# EAGLE design motor_module (EAGLE 6.5.0)
AUTHOR: Austin Buchan; DESIGN_NAME: MotorModule; REVISION: 0.0; YEAR: 2014

## Sheet 1 of 3: Power
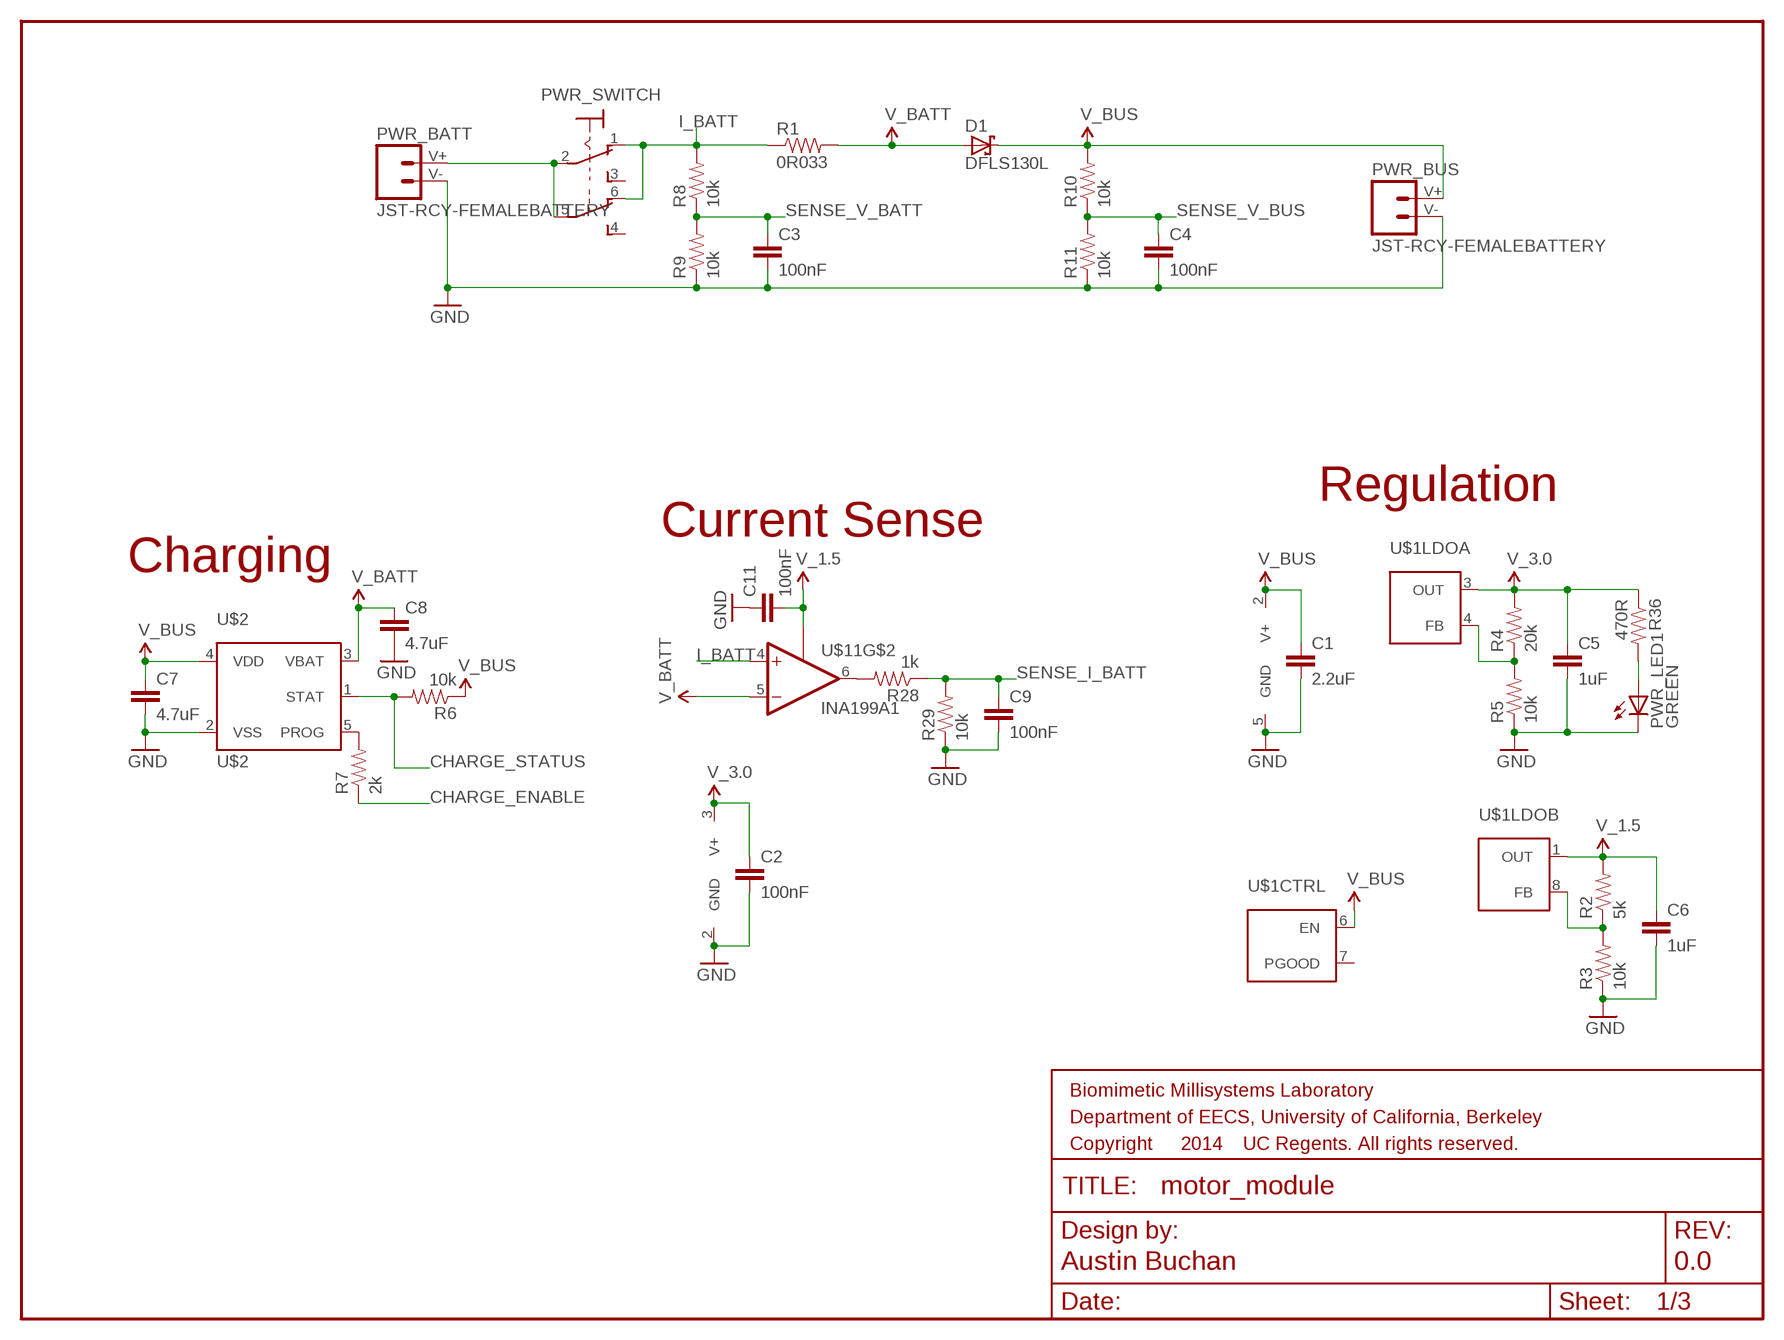
[diagram p0: schematic, sheet 1]
FRAME1 (FRAME-LETTER): SHEET_NAME: Power

### Parts
C1  2.2uF  CAP0402-CAP  [0402-CAP]
C2  100nF  CAP0402-CAP  [0402-CAP]
C3  100nF  CAP0402-CAP  [0402-CAP]
C4  100nF  CAP0402-CAP  [0402-CAP]
C5  1uF  CAP0402-CAP  [0402-CAP]
C6  1uF  CAP0402-CAP  [0402-CAP]
C7  4.7uF  CAP0402-CAP  [0402-CAP]
C8  4.7uF  CAP0402-CAP  [0402-CAP]
C9  100nF  CAP0402-CAP  [0402-CAP]
C11  100nF  CAP0402-CAP  [0402-CAP]
D1  DFLS130L  [POWERDI123]
PWR_BATT  JST-RCY-FEMALEBATTERY  [TP_LIPO_160MAH]
PWR_BUS  JST-RCY-FEMALEBATTERY  [TP_LIPO_160MAH]
PWR_LED1  GREEN  LED0603  [LED-0603]
PWR_SWITCH  JS202011SCQN  [JS202011SCQN]
R1  0R033  RESISTOR0603-RES  [0603-RES]
R2  5k  RESISTOR0402-RES  [0402-RES]
R3  10k  RESISTOR0402-RES  [0402-RES]
R4  20k  RESISTOR0402-RES  [0402-RES]
R5  10k  RESISTOR0402-RES  [0402-RES]
R6  10k  RESISTOR0402-RES  [0402-RES]
R7  2k  RESISTOR0402-RES  [0402-RES]
R8  10k  RESISTOR0402-RES  [0402-RES]
R9  10k  RESISTOR0402-RES  [0402-RES]
R10  10k  RESISTOR0402-RES  [0402-RES]
R11  10k  RESISTOR0402-RES  [0402-RES]
R28  1k  RESISTOR0402-RES  [0402-RES]
R29  10k  RESISTOR0402-RES  [0402-RES]
R36  470R  RESISTOR0402-RES  [0402-RES]
U$1  SC560C  [MLPQ-UT8]
U$2  MCP73831T  [SOT23-5]
U$11  INA199A1  [SC70-6]

### Nets
CHARGE_ENABLE: R7.1 ; also sheet 3
CHARGE_STATUS: R6.2 U$2.1(STAT) ; also sheet 3
GND: C1.2 C2.2 C3.2 C4.2 C5.2 C6.2 C7.2 C8.2 C9.2 C11.1 PWR_BATT.V- PWR_BUS.V- PWR_LED1.C R3.1 R5.1 R9.1 R11.1 R29.1 U$1.5(GND) U$2.2(VSS) U$11.2(GND) ; also sheet 2,3
I_BATT: PWR_SWITCH.1(O) PWR_SWITCH.6(O) R1.1 R8.2 U$11.4(+IN)
N$1: PWR_BATT.V+ PWR_SWITCH.2(P) PWR_SWITCH.5(P)
N$2: R2.1 R3.2 U$1.8(LDOB:FB)
N$3: R4.1 R5.2 U$1.4(LDOA:FB)
N$4: R7.2 U$2.5(PROG)
N$6: R28.2 U$11.6(OUT)
N$7: PWR_LED1.A R36.2
SENSE_I_BATT: C9.1 R28.1 R29.2 ; also sheet 3
SENSE_V_BATT: C3.1 R8.1 R9.2 ; also sheet 3
SENSE_V_BUS: C4.1 R10.1 R11.2 ; also sheet 3
V_1.5: C6.1 C11.2 R2.2 U$1.1(LDOB:OUT) U$11.1(REF) ; also sheet 2
V_3.0: C2.1 C5.1 R4.2 R36.1 U$1.3(LDOA:OUT) U$11.3(V+) ; also sheet 2,3
V_BATT: C8.1 D1.A R1.2 U$2.3(VBAT) U$11.5(-IN) ; also sheet 2
V_BUS: C1.1 C7.1 D1.C PWR_BUS.V+ R6.1 R10.2 U$1.2(V+) U$1.6(CTRL:EN) U$2.4(VDD)
Unconnected: PWR_SWITCH.3(S) PWR_SWITCH.4(S) U$1.7(CTRL:PGOOD)

### Notes on the sheet
- Regulation
- Current Sense
- Charging

## Sheet 2 of 3: Motor
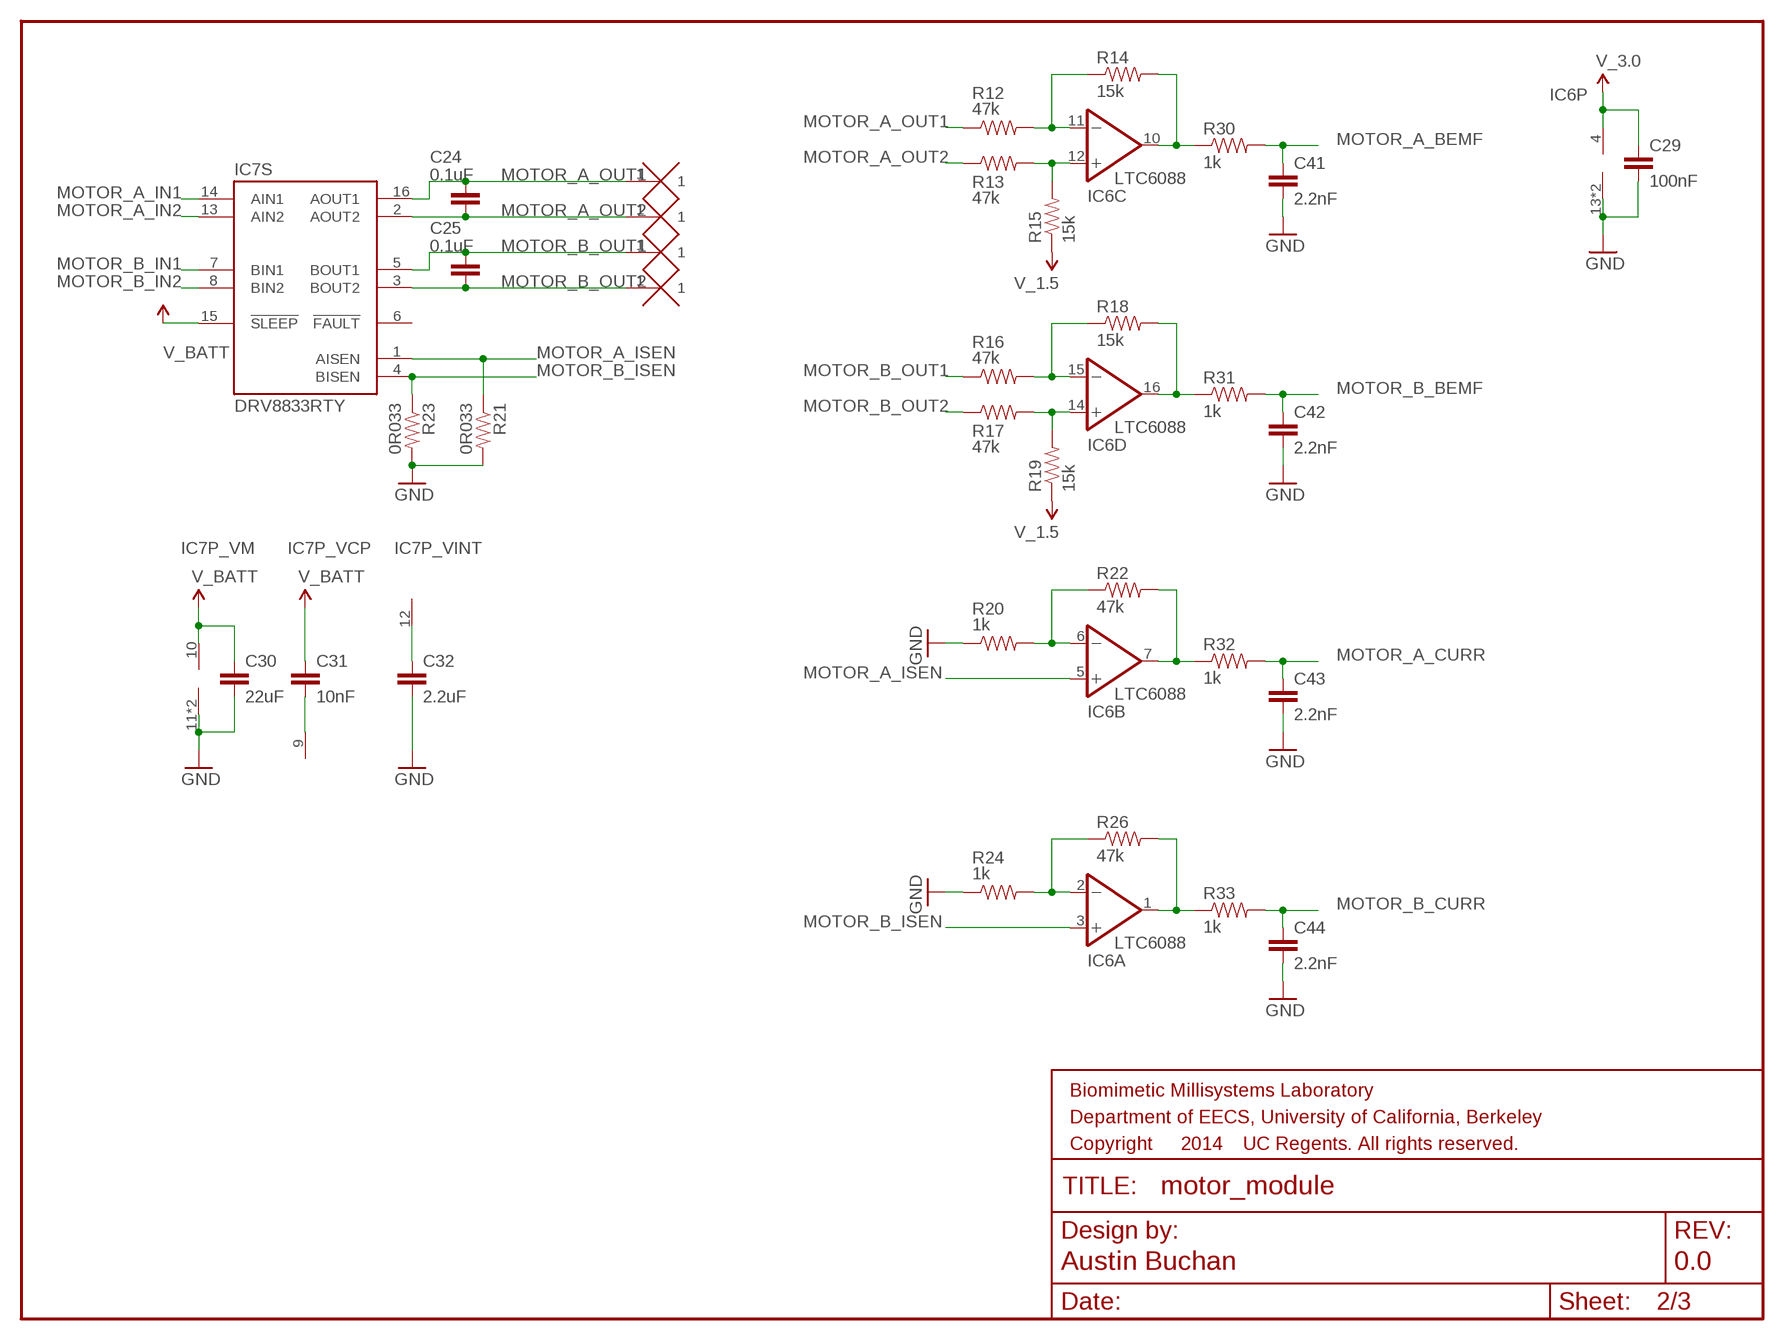
[diagram p1: schematic, sheet 2]
FRAME3 (FRAME-LETTER): SHEET_NAME: Motor

### Parts
C24  0.1uF  CAP0402-CAP  [0402-CAP]
C25  0.1uF  CAP0402-CAP  [0402-CAP]
C29  100nF  CAP0402-CAP  [0402-CAP]
C30  22uF  CAP0603-CAP  [0603-CAP]
C31  10nF  CAP0402-CAP  [0402-CAP]
C32  2.2uF  CAP0402-CAP  [0402-CAP]
C41  2.2nF  CAP0402-CAP  [0402-CAP]
C42  2.2nF  CAP0402-CAP  [0402-CAP]
C43  2.2nF  CAP0402-CAP  [0402-CAP]
C44  2.2nF  CAP0402-CAP  [0402-CAP]
IC6  LTC6088  [DFN-16]
IC7  DRV8833RTY  [S-PWQFN-N16]
MA1  PAD-0.6_1.8  [PAD_0.6_1.8]
MA2  PAD-0.6_1.8  [PAD_0.6_1.8]
MB1  PAD-0.6_1.8  [PAD_0.6_1.8]
MB2  PAD-0.6_1.8  [PAD_0.6_1.8]
R12  47k  RESISTOR0402-RES  [0402-RES]
R13  47k  RESISTOR0402-RES  [0402-RES]
R14  15k  RESISTOR0402-RES  [0402-RES]
R15  15k  RESISTOR0402-RES  [0402-RES]
R16  47k  RESISTOR0402-RES  [0402-RES]
R17  47k  RESISTOR0402-RES  [0402-RES]
R18  15k  RESISTOR0402-RES  [0402-RES]
R19  15k  RESISTOR0402-RES  [0402-RES]
R20  1k  RESISTOR0402-RES  [0402-RES]
R21  0R033  RESISTOR0603-RES  [0603-RES]
R22  47k  RESISTOR0402-RES  [0402-RES]
R23  0R033  RESISTOR0603-RES  [0603-RES]
R24  1k  RESISTOR0402-RES  [0402-RES]
R26  47k  RESISTOR0402-RES  [0402-RES]
R30  1k  RESISTOR0402-RES  [0402-RES]
R31  1k  RESISTOR0402-RES  [0402-RES]
R32  1k  RESISTOR0402-RES  [0402-RES]
R33  1k  RESISTOR0402-RES  [0402-RES]

### Nets
GND: C29.2 C30.2 C32.2 C41.2 C42.2 C43.2 C44.2 IC6.13(P:V-) IC6.PAD(P:V-) IC7.11(P_VM:V-) IC7.PPAD(P_VM:V-) R20.1 R21.2 R23.2 R24.1 ; also sheet 1,3
MOTOR_A_BEMF: C41.1 R30.2 ; also sheet 3
MOTOR_A_CURR: C43.1 R32.2 ; also sheet 3
MOTOR_A_IN1: IC7.14(S:AIN1) ; also sheet 3
MOTOR_A_IN2: IC7.13(S:AIN2) ; also sheet 3
MOTOR_A_ISEN: IC6.5(B:+IN) IC7.1(S:AISEN) R21.1
MOTOR_A_OUT1: C24.1 IC7.16(S:AOUT1) MA1.1 R12.1
MOTOR_A_OUT2: C24.2 IC7.2(S:AOUT2) MA2.1 R13.1
MOTOR_B_BEMF: C42.1 R31.2 ; also sheet 3
MOTOR_B_CURR: C44.1 R33.2 ; also sheet 3
MOTOR_B_IN1: IC7.7(S:BIN1) ; also sheet 3
MOTOR_B_IN2: IC7.8(S:BIN2) ; also sheet 3
MOTOR_B_ISEN: IC6.3(A:+IN) IC7.4(S:BISEN) R23.1
MOTOR_B_OUT1: C25.1 IC7.5(S:BOUT1) MB1.1 R16.1
MOTOR_B_OUT2: C25.2 IC7.3(S:BOUT2) MB2.1 R17.1
N$5: C31.2 IC7.9(P_VCP:V+)
N$18: C32.1 IC7.12(P_VINT:V-)
N$22: IC6.15(D:-IN) R16.2 R18.1
N$23: IC6.14(D:+IN) R17.2 R19.2
N$24: IC6.6(B:-IN) R20.2 R22.1
N$26: IC6.2(A:-IN) R24.2 R26.1
N$30: IC6.11(C:-IN) R12.2 R14.1
N$31: IC6.12(C:+IN) R13.2 R15.2
N$34: IC6.1(A:OUT) R26.2 R33.1
N$35: IC6.7(B:OUT) R22.2 R32.1
N$36: IC6.10(C:OUT) R14.2 R30.1
N$37: IC6.16(D:OUT) R18.2 R31.1
V_1.5: R15.1 R19.1 ; also sheet 1
V_3.0: C29.1 IC6.4(P:V+) ; also sheet 1,3
V_BATT: C30.1 C31.1 IC7.10(P_VM:V+) IC7.15(S:!SLEEP) ; also sheet 1
Unconnected: IC7.6(S:!FAULT)

## Sheet 3 of 3: Microcontroller
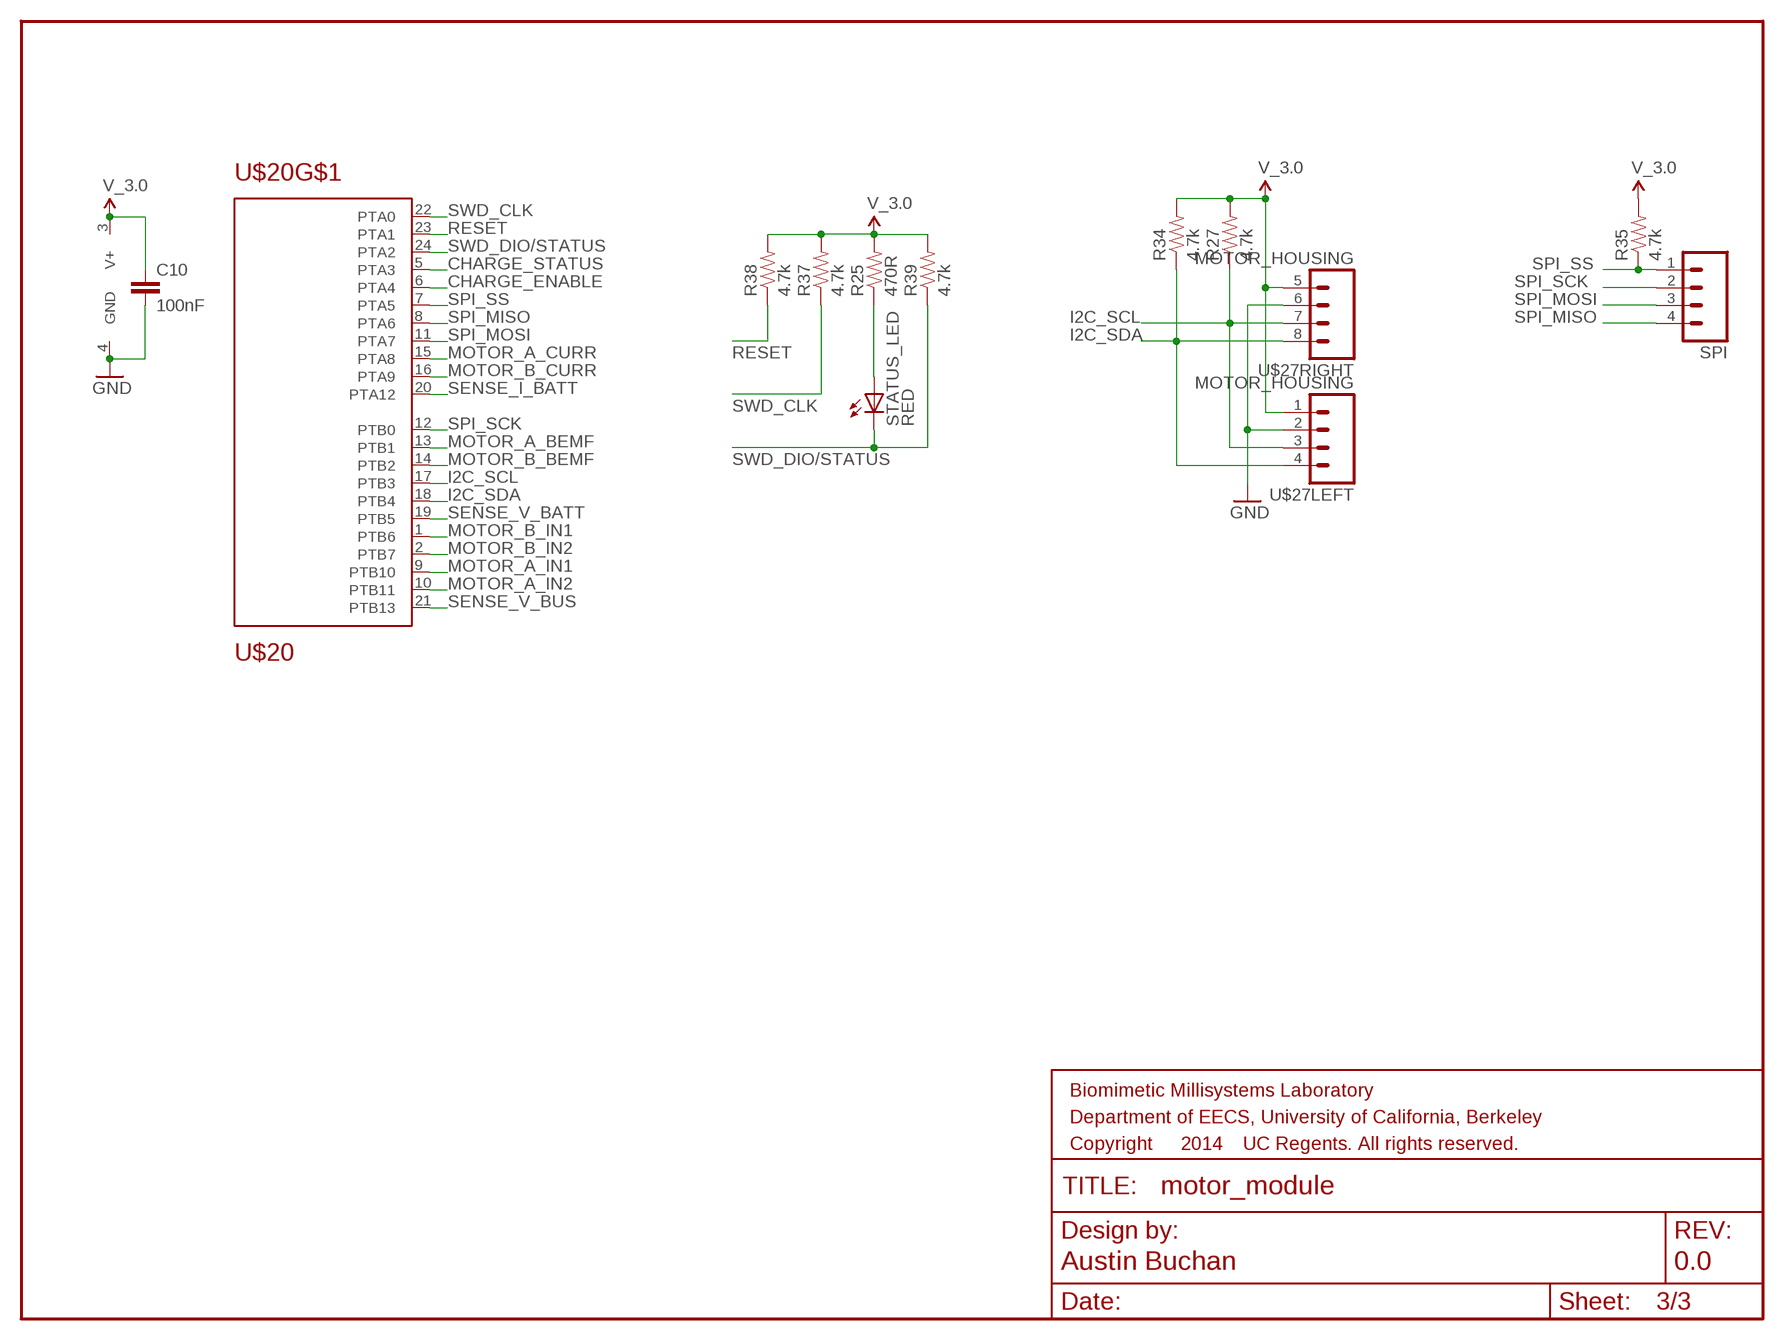
[diagram p2: schematic, sheet 3]

### Parts
C10  100nF  CAP0402-CAP  [0402-CAP]
R25  470R  RESISTOR0402-RES  [0402-RES]
R27  4.7k  RESISTOR0402-RES  [0402-RES]
R34  4.7k  RESISTOR0402-RES  [0402-RES]
R35  4.7k  RESISTOR0402-RES  [0402-RES]
R37  4.7k  RESISTOR0402-RES  [0402-RES]
R38  4.7k  RESISTOR0402-RES  [0402-RES]
R39  4.7k  RESISTOR0402-RES  [0402-RES]
SPI  M04FFC  [MOLEX_503480-0400]
STATUS_LED  RED  LED0603  [LED-0603]
U$20  MKL05Z32VFK4  [QFN-24]
U$27  MOTOR_HOUSING  [MOTOR_HOUSING]

### Nets
CHARGE_ENABLE: U$20.6(PTA4) ; also sheet 1
CHARGE_STATUS: U$20.5(PTA3) ; also sheet 1
GND: C10.2 U$20.4(GND) U$27.2 U$27.6 ; also sheet 1,2
I2C_SCL: R27.1 U$20.17(PTB3) U$27.3 U$27.7
I2C_SDA: R34.1 U$20.18(PTB4) U$27.4 U$27.8
MOTOR_A_BEMF: U$20.13(PTB1) ; also sheet 2
MOTOR_A_CURR: U$20.15(PTA8) ; also sheet 2
MOTOR_A_IN1: U$20.9(PTB10) ; also sheet 2
MOTOR_A_IN2: U$20.10(PTB11) ; also sheet 2
MOTOR_B_BEMF: U$20.14(PTB2) ; also sheet 2
MOTOR_B_CURR: U$20.16(PTA9) ; also sheet 2
MOTOR_B_IN1: U$20.1(PTB6) ; also sheet 2
MOTOR_B_IN2: U$20.2(PTB7) ; also sheet 2
N$8: R25.1 STATUS_LED.A
RESET: R38.1 U$20.23(PTA1)
SENSE_I_BATT: U$20.20(PTA12) ; also sheet 1
SENSE_V_BATT: U$20.19(PTB5) ; also sheet 1
SENSE_V_BUS: U$20.21(PTB13) ; also sheet 1
SPI_MISO: SPI.4 U$20.8(PTA6)
SPI_MOSI: SPI.3 U$20.11(PTA7)
SPI_SCK: SPI.2 U$20.12(PTB0)
SPI_SS: R35.1 SPI.1 U$20.7(PTA5)
SWD_CLK: R37.1 U$20.22(PTA0)
SWD_DIO/STATUS: R39.1 STATUS_LED.C U$20.24(PTA2)
V_3.0: C10.1 R25.2 R27.2 R34.2 R35.2 R37.2 R38.2 R39.2 U$20.3(V+) U$27.1 U$27.5 ; also sheet 1,2

## Library data of the parts
C1-C11 C29 C30 C41-C44 = biomimetic:CAP: Capacitor Standard 0603 ceramic capacitor, and 0.1" leaded capacitor.
C24 C25 = biomimetic:CAP: Capacitor Standard 0603 ceramic capacitor, and 0.1" leaded capacitor.; TECHNOLOGY: CERAMIC; VOLTAGE: 10V
C31 = biomimetic:CAP: Capacitor Standard 0603 ceramic capacitor, and 0.1" leaded capacitor.; DIELECTRIC: X7R; TECHNOLOGY: CERAMIC; VOLTAGE: 16V
C32 = biomimetic:CAP: Capacitor Standard 0603 ceramic capacitor, and 0.1" leaded capacitor.; TECHNOLOGY: CERAMIC; VOLTAGE: 6.3V
D1 = modular_robotics:DFLS130L
IC6 = biomimetic:LTC6088: 14MHz, Rail-to-Rail Output, 12nV/Hz, 1.1mA Op Amp Source: http://cds.linear.com/docs/Datasheet/60878fb.pdf Digi-Key P/N: LTC6088HDHC#PBF-ND
IC7 = biomimetic:DRV8833: TI DRV8833 1.5A Dual H-Bridge Motor Driver IC Digi-Key P/N: 296-29513-6-ND
MA1 MA2 MB1 MB2 = modular_robotics:PAD
PWR_BATT PWR_BUS = modular_robotics:JST-RCY-FEMALE
PWR_LED1 STATUS_LED = biomimetic:LED: LEDs Standard schematic elements and footprints for 5mm, 3mm, 1206, and 0603 sized LEDs. 5mm - Spark Fun Electronics SKU : COM-00529 (and others)
PWR_SWITCH = modular_robotics:JS202011SCQN
R1-R11 R21 R23 R25 R27-R39 = biomimetic:RESISTOR: Resistor Basic schematic elements and footprints for 0603, 1206, and PTH resistors.
R12-R20 R22 R24 R26 = biomimetic:RESISTOR: Resistor Basic schematic elements and footprints for 0603, 1206, and PTH resistors.; TOLERANCE: 1%
SPI = modular_robotics:M04: Header 4 Standard 4-pin 0.1" header. Use with straight break away headers (SKU : PRT-00116), right angle break away headers (PRT-00553), swiss pins (PRT-00743), machine pins (PRT-00117), and female headers (PRT-00115). Molex polarized connector foot print use with SKU : PRT-08231 with associated crimp pins and housings. 1MM SMD Version SKU: PRT-10208
U$1 = modular_robotics:SC560C
U$2 = modular_robotics:MCP73831T
U$11 = modular_robotics:INA199A1
U$20 = modular_robotics:MKL05Z32VFK4
U$27 = modular_robotics:MOTOR_HOUSING

## Board
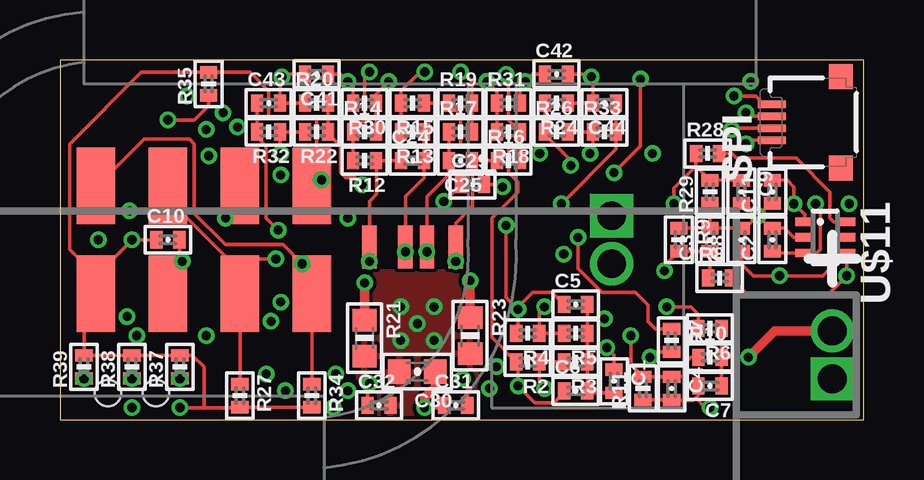
[diagram p3: board, top side]
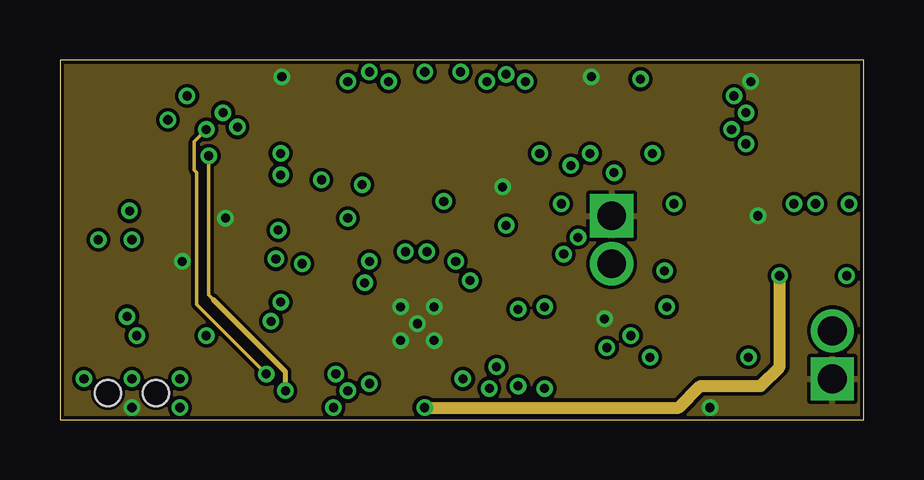
[diagram p4: board, inner layer Route2]
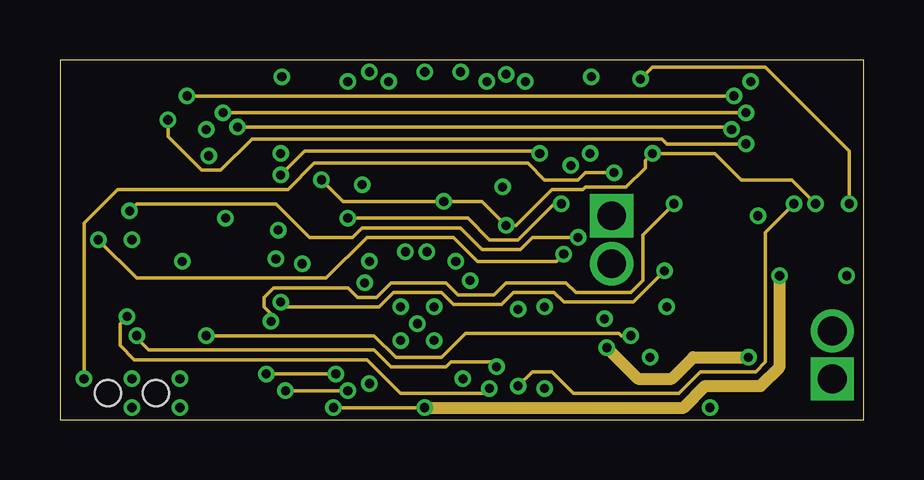
[diagram p5: board, inner layer Route15]
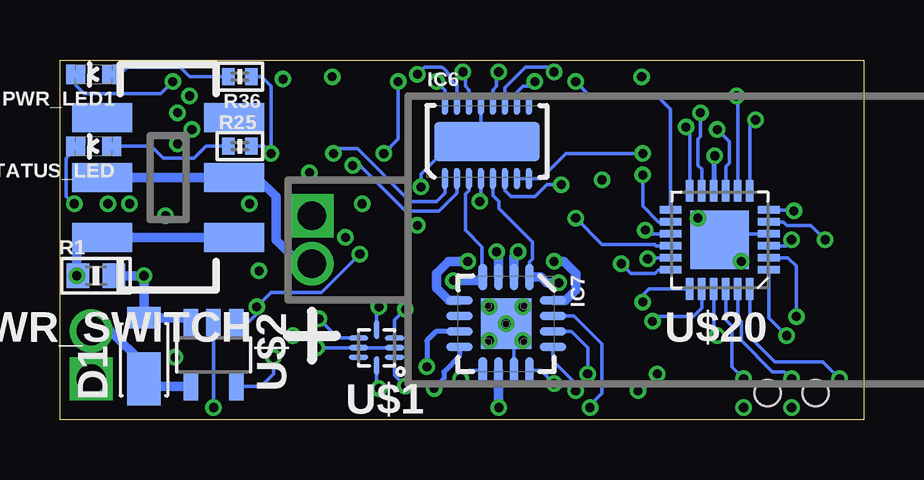
[diagram p6: board, bottom side, seen from below]

Size 33.5 x 15 mm. Coordinates in mm from the lower left corner, seen from the top.
Outline: 0,15 0,0 33.5,0 33.5,15 0,15
Copper layers (1*2+15*16): Top 0.035mm / dielectric 1.5mm / Route2 0.035mm / dielectric 0.15mm / Route15 0.035mm / dielectric 0.2mm / Bottom 0.035mm
Design rules "66each *": minimum track width 6mil, minimum drill 15mil, track to track 6mil, track to pad 6mil, pad to pad 6mil, via to via 6mil, smd to smd 6mil, copper to edge 6mil, drill to drill 6mil, minimum pad ring 6mil, minimum via ring 6mil, stop-mask expansion 4mil, vias tented up to drill 25mil, thermal gap 6mil
Holes 1.1 mm at 2,1.1 4,1.1

### Footprints (pad centres in the part's own frame; a part is rotated, then mirrored left to right if it is on the bottom)
0402-CAP = smd 0.508 x 0.711: 1 -0.483,0; 2 0.483,0
0603-CAP = smd 0.94 x 1.016: 1 -0.749,0; 2 0.749,0
POWERDI123 = smd 0.9 x 1.4: A 0.95,0 | smd 2.2 x 1.4: C -1.6,0
DFN-16 = smd 0.25 x 0.9: 1 -1.75,-1.55; 2 -1.25,-1.55; 3 -0.75,-1.55; 4 -0.25,-1.55; 5 0.25,-1.55; 6 0.75,-1.55; 7 1.25,-1.55; 8 1.75,-1.55; 9 1.75,1.55; 10 1.25,1.55; 11 0.75,1.55; 12 0.25,1.55; 13 -0.25,1.55; 14 -0.75,1.55; 15 -1.25,1.55; 16 -1.75,1.55 | smd 4.4 x 1.65: PAD 0,0
S-PWQFN-N16 = smd 1.1 x 0.35: 1 -1.95,0.975; 2 -1.95,0.325; 3 -1.95,-0.325; 4 -1.95,-0.975; 9 1.95,-0.975; 10 1.95,-0.325; 11 1.95,0.325; 12 1.95,0.975 | smd 0.35 x 1.1: 5 -0.975,-1.95; 6 -0.325,-1.95; 7 0.325,-1.95; 8 0.975,-1.95; 13 0.975,1.95; 14 0.325,1.95; 15 -0.325,1.95; 16 -0.975,1.95 | smd 2.1 x 2.1: PPAD 0,0
PAD_0.6_1.8 = smd 0.6 x 1.8: 1 0,0
TP_LIPO_160MAH = drill 1.2 pad 1.6: V+ -1,0 | drill 1.2 pad 1.6 square: V- 1,0
LED-0603 = smd 0.8 x 0.8: A 0,-0.75; C 0,0.75
JS202011SCQN = smd 1.2 x 2.5: 1 -2.5,-2.75; 2 0,-2.75; 3 2.5,-2.75; 4 2.5,2.75; 5 0,2.75; 6 -2.5,2.75
0603-RES = smd 0.94 x 1.016: 1 -0.749,0; 2 0.749,0
0402-RES = smd 0.508 x 0.711: 1 -0.483,0; 2 0.483,0
MOLEX_503480-0400 = smd 0.3 x 1.15: 1 -0.75,1.725; 2 -0.25,1.725; 3 0.25,1.725; 4 0.75,1.725 | smd 1.035 x 1: L -1.907,-1.15; R 1.907,-1.15
MLPQ-UT8 = smd 0.8 x 0.2: 1 -0.75,0.4; 2 -0.75,0; 3 -0.75,-0.4; 5 0.75,-0.4; 6 0.75,0; 7 0.75,0.4 | smd 0.2 x 0.8: 4 0,-0.75; 8 0,0.75
SOT23-5 = smd 0.6 x 1.2: 1 -0.95,-1.306; 2 0,-1.306; 3 0.95,-1.306; 4 0.95,1.306; 5 -0.95,1.306
SC70-6 = smd 0.35 x 0.8: 1 -0.65,-0.85; 2 0,-0.85; 3 0.65,-0.85; 4 0.65,0.85; 5 0,0.85; 6 -0.65,0.85
QFN-24 = smd 0.9 x 0.3: 1 -2.05,1.25; 2 -2.05,0.75; 3 -2.05,0.25; 4 -2.05,-0.25; 5 -2.05,-0.75; 6 -2.05,-1.25; 13 2.05,-1.25; 14 2.05,-0.75; 15 2.05,-0.25; 16 2.05,0.25; 17 2.05,0.75; 18 2.05,1.25 | smd 0.3 x 0.9: 7 -1.25,-2.05; 8 -0.75,-2.05; 9 -0.25,-2.05; 10 0.25,-2.05; 11 0.75,-2.05; 12 1.25,-2.05; 19 1.25,2.05; 20 0.75,2.05; 21 0.25,2.05; 22 -0.25,2.05; 23 -0.75,2.05; 24 -1.25,2.05 | smd 2.45 x 2.45: EP 0,0
MOTOR_HOUSING = smd 1.6 x 3.2: 1 -4.5,-2.25; 2 -1.5,-2.25; 3 1.5,-2.25; 4 4.5,-2.25; 5 4.5,2.25; 6 1.5,2.25; 7 -1.5,2.25; 8 -4.5,2.25

### Placement (x,y rotation side)
C1  23.1,1.6 270 top
C2  29.7,7.5 90 top
C3  27.1,7.5 90 top
C4  25.5,1.3 270 top
C5  21.5,4.8 0 top
C6  21.5,1.2 0 top
C7  27.1,1.4 180 top
C8  28.4,7.5 90 top
C9  28.4,9.5 270 top
C10  4.5,7.5 0 top
C11  29.7,9.5 90 top
C24  14.7,10.8 0 top
C25  16.7,10.8 180 top
C29  17.2,9.8 0 top
C30  14.9,2 180 top
C31  16.5,0.6 0 top
C32  13.3,0.6 0 top
C41  10.7,14.4 180 top
C42  20.7,14.4 0 top
C43  8.7,13.2 0 top
C44  22.7,13.2 180 top
D1  30,3.3 90 bottom
IC6  15.7,11.6 0 bottom
IC7  14.9,4 270 bottom
MA1  12.9,7.2 0 top
MA2  14.4,7.2 180 top
MB1  16.5,7.2 0 top
MB2  15.3,7.2 180 top
PWR_BATT  23,7.5 90 bottom
PWR_BUS  32.2,2.7 270 top
PWR_LED1  32.1,14.4 90 bottom
PWR_SWITCH  29,10.1 90 bottom
R1  32,6 0 bottom
R2  19.5,2.4 180 top
R3  21.5,2.4 180 top
R4  19.5,3.6 180 top
R5  21.5,3.6 180 top
R6  27.1,3.8 180 top
R7  25.5,3.3 270 top
R8  27.5,5.9 0 top
R9  25.8,7.5 270 top
R10  27.1,2.6 0 top
R11  24.3,1.3 90 top
R12  12.7,10.8 180 top
R13  14.7,12 180 top
R14  12.7,12 0 top
R15  14.7,13.2 180 top
R16  18.7,10.8 0 top
R17  16.7,12 0 top
R18  18.7,12 180 top
R19  16.7,13.2 0 top
R20  10.7,13.2 0 top
R21  12.7,3.4 270 top
R22  10.7,12 180 top
R23  17.1,3.5 270 top
R24  20.7,13.2 180 top
R25  26,11.4 0 bottom
R26  20.7,12 0 top
R27  7.5,1 270 top
R28  27,11.1 0 top
R29  27.1,9.5 90 top
R30  12.7,13.2 180 top
R31  18.7,13.2 0 top
R32  8.7,12 180 top
R33  22.7,12 0 top
R34  10.5,1 270 top
R35  6.2,14 90 top
R36  26,14.3 180 bottom
R37  5,2.2 90 top
R38  3,2.2 90 top
R39  1,2.2 90 top
SPI  31.4,12.4 90 top
STATUS_LED  32.1,11.4 90 bottom
U$1  20.3,3 180 bottom
U$2  27.1,2.7 180 bottom
U$11  31.9,7.6 270 top
U$20  6,7.5 180 bottom
U$27  6,7.5 0 top

### Tracks (layer width: path | path; a pad name or v marks a point on that pad's centre or on a via)
CHARGE_ENABLE  (via drill 0.38)
  Top 0.152: v21.6,7.6 21.6,6.3 22.6,5.3 23.98,5.3 24.5,4.78 24.5,4.1 24.82,3.78 R7.1
  Route15 0.152: v21.6,7.6 19.7,7.6 19.2,7.1 17.6,7.1 16.7,8 12.6,8 12.2,7.6 10.4,7.6 9,9 3.2,9 v2.9,8.7
  Bottom 0.152: v2.9,8.7 2.95,8.75 U$20.6
CHARGE_STATUS  (via drill 0.38)
  Top 0.152: R6.2 26.62,4.38 26.3,4.7 v25.3,4.7
  Route15 0.152: v21,6.9 20.7,6.6 17.4,6.6 16.4,7.6 12.8,7.6 11.1,5.9 3.2,5.9 v1.6,7.5
  Bottom 0.152: U$2.1 25.69,4.01 25.3,4.4 v25.3,4.7 24.7,5.3 22.6,5.3 v21,6.9 | U$20.5 3.35,8.25 3.2,8.1 2.2,8.1 v1.6,7.5
GND  (via drill 0.38)
  Top 0.152: C3.2 R9.1 | U$11.2 30.6,7.6 30.2,8 29.72,8 C2.2 29.62,7.98 v29.1,8.5 | C7.2 26.62,1.02 26.5,0.9 | 26.5,0.9 26.4,0.8 25.52,0.8 C4.2 R11.1 | v27.1,0.5 26.9,0.5 26.5,0.9 | C5.2 21.98,4.2 | 21.98,4.2 v22.7,4.2 | 21.98,4.2 R5.1 R3.1 C6.2 22.07,1.12 C1.2 | R24.1 C44.2 22.22,14.23 v22.15,14.3 22.05,14.4 C42.2 | C41.2 9.35,14.4 v9.25,14.3 9.18,14.23 C43.2 R20.1 | U$27.2 5.1,5.85 v5.1,6.6 4.98,6.72 C10.2 | U$27.6 7.5,9 v6.9,8.4 | C29.2 18.35,9.8 v18.45,9.7 | v29.1,8.5 29.62,9.02 C11.1 | v29.1,8.5 28.58,9.02 C9.2 | v29.1,8.5 28.58,7.98 C8.2 C3.2 | R29.1 C3.2
  Bottom 0.152: U$2.2 v27.1,0.5 | U$1.5 21.9,3.4 v22.7,4.2 | PWR_LED1.C 32.85,13.95 32.5,13.6 29.3,13.6 v28.8,14.1 | IC7.11 14.57,2.92 v14.2,3.3 | IC6.PAD 15.7,11.9 | IC6.PAD 17.1,11.6 18.45,10.25 v18.45,9.7 | IC6.13 15.95,11.85 IC6.PAD | U$20.4 5.15,7.75 5.15,6.65 v5.1,6.6
  other vias: 15.6,3.3 14.9,4 14.2,4.7 15.6,4.7 3,0.5
  pour Route2: 33.5,15 33.5,0 0,0 0,15
  pour Top (isolate 0.152): 17.4,6.2 17.4,0 12.4,0 12.4,6.2
I2C_SCL  (via drill 0.38)
  Top 0.152: 7.5,6.2 U$27.3 R27.1 | U$27.7 4.5,9.1 4.9,8.7 5,8.7 7.5,6.2 | v9,6.7 8,6.7 7.5,6.2
  Bottom 0.152: U$20.17 8.95,6.75 v9,6.7
I2C_SDA  (via drill 0.38)
  Top 0.152: R34.1 U$27.4 10.5,6.1 v10.1,6.5 9.3,7.3 6.9,7.3 5.6,8.6 5.6,11.5 5.4,11.7 3.5,11.7 1.55,9.75 U$27.8
  Bottom 0.152: U$20.18 8.55,6.25 8.7,6.1 9.7,6.1 v10.1,6.5
I_BATT  (via drill 0.38)
  Top 0.152: R8.2 28.68,5.2 32,5.2 v32.8,6 32.8,6.95 U$11.4
  Bottom 0.4: PWR_SWITCH.1 PWR_SWITCH.6 32.8,7.6 v32.8,6 R1.1
MOTOR_A_BEMF  (via drill 0.38)
  Top 0.152: C41.1 11.7,14.4 v12,14.1 12.22,13.88 R30.2
  Bottom 0.152: U$20.13 8.05,12.95 8.6,13.5 11.4,13.5 v12,14.1
MOTOR_A_CURR  (via drill 0.38)
  Top 0.152: C43.1 R32.2 8.22,11.78 8.6,11.4 8.6,8.4 v9.1,7.9
  Bottom 0.152: U$20.15 8.95,7.75 v9.1,7.9
MOTOR_A_IN1  (via drill 0.38)
  Route2 0.152: v8.6,1.9 5.7,4.8 5.7,10.3 5.6,10.4 5.6,11.6 v6.1,12.1
  Route15 0.152: v11.5,1.9 v8.6,1.9
  Bottom 0.152: IC7.14 12.18,3.67 11.5,3 v11.5,1.9 | v6.1,12.1 5.6,11.6 5.6,10.7 5.75,10.55 U$20.9
MOTOR_A_IN2  (via drill 0.38)
  Route2 0.152: 6.4,5 6.2,5.2 v6.2,11
  Route2 0.2: v9.4,1.2 9.4,2 6.4,5
  Route15 0.152: v12,1.2 v9.4,1.2
  Bottom 0.152: v12,1.2 12,1.5 12.95,2.45 IC7.13
  Bottom 0.2: v6.2,11 6.25,10.95 U$20.10
MOTOR_A_ISEN  (via drill 0.38)
  Top 0.4: R21.1 v12.7,5.7
  Bottom 0.152: IC7.1 13.93,6.58 13.8,6.7 13.8,7.4 15.2,8.8 15.2,9.1 15.45,9.35 IC6.5
  Bottom 0.4: IC7.1 13.45,5.95 13.2,5.7 v12.7,5.7
MOTOR_A_OUT1  (via drill 0.38)
  Top 0.152: C24.1 R12.1 13.2,10.78 13.2,9.4 12.9,9.1 MA1.1
  Top 0.4: v12.9,6.6 MA1.1
  Bottom 0.4: IC7.16 12.43,4.97 12,5.4 12,6.1 12.5,6.6 v12.9,6.6
MOTOR_A_OUT2  (via drill 0.38)
  Top 0.152: R13.1 C24.2 15.18,10.08 14.4,9.3 MA2.1
  Top 0.4: v14.4,7 MA2.1
  Bottom 0.4: IC7.2 14.57,6.83 v14.4,7
MOTOR_B_BEMF  (via drill 0.38)
  Top 0.152: C42.1 19.7,14.4 v19.4,14.1 19.18,13.88 R31.2
  Route15 0.152: v9.2,10.2 10.2,11.2 19.9,11.2 v20,11.1
  Bottom 0.152: v19.4,14.1 19.4,11.7 v20,11.1 | U$20.14 8.55,8.25 9.2,8.9 v9.2,10.2
MOTOR_B_CURR  (via drill 0.38)
  Top 0.152: C44.1 R33.2 23.18,11.28 v20.9,9
  Route15 0.152: v20.9,9 20.6,9 19.1,7.5 17.9,7.5 17,8.4 v12,8.4
  Bottom 0.152: U$20.16 8.65,7.25 8.7,7.3 10.9,7.3 v12,8.4
MOTOR_B_IN1  (via drill 0.38)
  Route15 0.152: v18.2,2.2 18,2.4 16.3,2.4 16.1,2.2 13.8,2.2 13.1,2.9 3.7,2.9 3.2,3.4 v3.2,3.5
  Bottom 0.152: U$20.1 3.95,4.25 v3.2,3.5
  Bottom 0.2: IC7.7 17.82,3.67 18.2,3.3 v18.2,2.2
MOTOR_B_IN2  (via drill 0.38)
  Route15 0.152: v17.9,1.3 17.7,1.1 14.2,1.1 12.8,2.5 3.1,2.5 2.5,3.1 2.5,4 v2.8,4.3
  Bottom 0.152: U$20.2 3.15,6.75 2.8,6.4 v2.8,4.3
  Bottom 0.2: IC7.8 16.85,2.65 17.5,2 17.5,1.7 v17.9,1.3
MOTOR_B_ISEN  (via drill 0.38)
  Top 0.4: R23.1 v17.1,5.8
  Bottom 0.152: IC6.3 16.45,9.55 16.6,9.4 16.6,7.9 15.9,7.2 15.9,5.97 IC7.4
  Bottom 0.4: IC7.4 16.02,5.8 v17.1,5.8
MOTOR_B_OUT1  (via drill 0.38)
  Top 0.152: R16.1 C25.1 17.2,10.78 17.2,8.9 16.5,8.2 MB1.1
  Top 0.4: v16.5,6.6 MB1.1
  Bottom 0.4: IC7.5 17.27,4.97 17.8,5.5 17.8,6.1 17.3,6.6 v16.5,6.6
MOTOR_B_OUT2  (via drill 0.38)
  Top 0.152: R17.1 C25.2 16.22,10.22 15.3,9.3 MB2.1
  Top 0.4: v15.3,7 MB2.1
  Bottom 0.4: IC7.3 15.22,6.92 v15.3,7
N$1
  Bottom 0.4: PWR_SWITCH.5 PWR_SWITCH.2 25.3,10.1 24.5,9.3 24.5,7.5 23.5,6.5 PWR_BATT.V+
N$2  (via drill 0.38)
  Top 0.152: R3.2 R2.1 19.98,1.52 v20.2,1.3
  Bottom 0.152: U$1.8 20.3,1.4 v20.2,1.3
N$3  (via drill 0.38)
  Top 0.152: R5.2 R4.1 19.98,4.48 v20.2,4.7
  Bottom 0.152: U$1.4 20.3,4.6 v20.2,4.7
N$4  (via drill 0.38)
  Top 0.152: R7.2 24.82,2.82 v24.6,2.6
  Bottom 0.152: U$2.5 25.11,1.39 24.6,1.9 v24.6,2.6
N$5  (via drill 0.38)
  Top 0.152: C31.2 16.98,1.52 v16.8,1.7
  Bottom 0.152: IC7.9 16.45,2.05 v16.8,1.7
N$6
  Top 0.152: U$11.6 32.25,8.25 32.1,8.4 32.1,9.5 30.7,10.9 28.2,10.9 28,11.1 R28.2
N$7
  Bottom 0.152: 26.58,14.4 R36.2 28.1,14.3 28.5,14.7 30.7,14.7 31,14.4 PWR_LED1.A
N$8
  Bottom 0.152: STATUS_LED.A 29.7,11.4 29.2,10.9 27.9,10.9 27.4,11.4 R25.1
N$18  (via drill 0.38)
  Top 0.152: C32.1 12.82,1.42 v12.9,1.5
  Bottom 0.152: v12.9,1.5 13.45,2.05 IC7.12
N$22  (via drill 0.38)
  Top 0.152: R16.2 R18.1 18.7,12.48 18.7,13.9 18.6,14 v18.6,14.4
  Bottom 0.152: IC6.15 16.95,13.95 arc40 17.24,14.27 arc-46 17.6,14.7 18.3,14.7 v18.6,14.4
N$23  (via drill 0.38)
  Top 0.152: R17.2 R19.2 17.18,14.12 16.8,14.5 v16.7,14.5
  Bottom 0.152: IC6.14 16.45,13.75 16.6,13.9 16.6,14.4 v16.7,14.5
N$24  (via drill 0.38)
  Top 0.152: R20.2 R22.1 11.18,11.92 11.7,11.4 11.7,10.3 11.9,10.1 12.3,10.1 v12.6,9.8
  Bottom 0.152: v12.6,9.8 13.2,9.8 13.7,9.3 14.7,9.3 14.95,9.55 IC6.6
N$26  (via drill 0.38)
  Top 0.152: R24.2 R26.1 20.22,11.88 21.3,10.8 v21.3,10.6
  Bottom 0.152: IC6.2 16.95,9.45 17.7,8.7 19.1,8.7 21,10.6 v21.3,10.6
N$30  (via drill 0.38)
  Top 0.152: R12.2 R14.1 12.7,12.48 12.7,14.3 v12.9,14.5
  Bottom 0.152: IC6.11 14.95,13.85 14.1,14.7 13.1,14.7 v12.9,14.5
N$31  (via drill 0.38)
  Top 0.152: R15.2 R13.2 | 14.2,13.22 R15.2 | R15.2 14.22,13.72 15,14.5 v15.21,14.5
  Bottom 0.152: IC6.12 15.45,13.75 15.3,13.9 15.3,14.41 v15.21,14.5
N$34  (via drill 0.38)
  Top 0.152: R26.2 R33.1 22.22,11.22 v22.1,11.1
  Bottom 0.152: IC6.1 17.45,9.45 17.8,9.1 18.9,9.1 21.1,11.3 21.9,11.3 v22.1,11.1
N$35  (via drill 0.38)
  Top 0.152: R22.2 R32.1 9.18,11.12 v9.2,11.1
  Bottom 0.152: IC6.7 13.45,10.05 12.4,11.1 v9.2,11.1
N$36  (via drill 0.38)
  Top 0.152: R14.2 R30.1 13.18,13.58 v13.7,14.1
  Bottom 0.152: IC6.10 14.45,13.65 14.2,13.9 13.9,13.9 v13.7,14.1
N$37  (via drill 0.38)
  Top 0.152: R18.2 R31.1 18.22,13.68 v17.8,14.1
  Bottom 0.152: IC6.16 17.45,13.75 v17.8,14.1
RESET  (via drill 0.38)
  Top 0.152: R38.1 v3,1.7 3,1.62
  Bottom 0.152: U$20.23 5.25,4.25 5.1,4.1 5.1,3.3 3.8,2 3.3,2 v3,1.7
SENSE_I_BATT  (via drill 0.38)
  Top 0.152: C9.1 R29.2 26.52,10.56 | R28.1 26.52,10.56 | 26.52,10.56 25.6,9.65 v25.6,9
  Route15 0.152: v25.6,9 24.3,7.7 24.3,5.8 23.8,5.3 21.5,5.3 21.1,5.7 18.6,5.7 18.1,5.2 16.6,5.2 16.1,5.7 13.8,5.7 13.2,5.1 12.4,5.1 12,5.5 8.9,5.5 8.5,5.1 8.5,4.7 8.8,4.4 v8.8,4.1
  Bottom 0.152: U$20.20 6.75,4.65 7.1,4.3 8.6,4.3 v8.8,4.1
SENSE_V_BATT  (via drill 0.38)
  Top 0.152: R8.1 27.1,5.98 C3.1 R9.2 25.2,6.42 v25.2,6.2
  Route15 0.152: v25.2,6.2 23.9,4.9 21,4.9 20.6,5.3 18.9,5.3 18.4,4.8 16.4,4.8 15.9,5.3 13.9,5.3 13.3,4.7 9.4,4.7 v9.2,4.9
  Bottom 0.152: U$20.19 8.95,5.45 9.2,5.2 v9.2,4.9
SENSE_V_BUS  (via drill 0.38)
  Top 0.152: R10.1 26.3,2.6 26.1,2.4 26.1,1.9 26,1.8 25.52,1.8 C4.1 R11.2 24.3,1.8 23.8,2.3 v23.8,3.5
  Route15 0.152: v6.1,3.5 13.1,3.5 14,2.6 15.9,2.6 16.9,3.6 23.3,3.6 23.4,3.5 v23.8,3.5
  Bottom 0.152: v6.1,3.5 6.25,3.65 U$20.21
SPI_MISO  (via drill 0.38)
  Top 0.152: SPI.4 29.35,13.15 29,13.5 v28.1,13.5
  Route15 0.152: v28.1,13.5 v5.3,13.5
  Bottom 0.152: v5.3,13.5 5.25,13.45 U$20.8
SPI_MOSI  (via drill 0.38)
  Top 0.152: v28.6,12.8 28.75,12.65 SPI.3
  Route15 0.152: v28.6,12.8 v6.8,12.8
  Bottom 0.152: U$20.11 6.75,10.45 6.9,10.6 6.9,11.7 6.8,11.8 v6.8,12.8
SPI_SCK  (via drill 0.38)
  Top 0.152: SPI.2 28.05,12.15 v28,12.1
  Route15 0.152: 27.9,12.2 v7.4,12.2
  Route15 0.2: v28,12.1 27.9,12.2
  Bottom 0.152: U$20.12 7.25,12.05 v7.4,12.2
SPI_SS  (via drill 0.38)
  Top 0.152: v28.6,11.5 28.75,11.65 SPI.1 | v4.5,12.5 5.6,12.5 6.2,13.1 R35.1
  Route15 0.152: v28.6,11.5 25.3,11.5 25.1,11.7 8,11.7 6.7,10.4 5.9,10.4 4.5,11.8 v4.5,12.5
  Bottom 0.152: v4.5,12.5 4.75,12.25 U$20.7
SWD_CLK  (via drill 0.38)
  Top 0.152: v5,1.7 4.98,1.72 R37.1
  Bottom 0.152: U$20.22 5.75,4.15 5.5,3.9 5.5,2.2 v5,1.7
SWD_DIO/STATUS  (via drill 0.38)
  Top 0.152: v24.2,14.2 24.2,11.4 v23.1,10.3 | R39.1 v1,1.7
  Route15 0.152: v32.9,9 32.9,11.2 29.4,14.7 24.7,14.7 v24.2,14.2 | v23.1,10.3 21.9,10.3 21.6,10 20.2,10 19.5,10.7 10.6,10.7 9.5,9.6 2.4,9.6 1,8.2 v1,1.7
  Bottom 0.152: 32.85,11.25 STATUS_LED.C 32.85,11.3 33.25,10.9 33.25,9.3 32.95,9 v32.9,9 | U$20.24 4.75,3.45 3.7,2.4 1.7,2.4 v1,1.7
V_1.5  (via drill 0.38)
  Top 0.152: U$11.1 31.05,8.55 v30.6,9 30.6,9.7 30.32,9.98 C11.2 | 21.02,1.1 C6.1 21.02,1.12 20.6,0.7 19.8,0.7 v19.1,1.4 19.1,2.4 R2.2 18,3.42 18,8.4 19.1,9.5 19.1,9.9 18.7,10.3 18.7,11.3 18.6,11.4 16.8,11.4 16.7,11.5 16.7,12.72 R19.1 R15.1
  Route15 0.152: v30.6,9 29.4,7.8 29.4,2.4 29,2 26.7,2 25.8,1.1 21.4,1.1 20.5,2 19.7,2 v19.1,1.4
  Bottom 0.152: U$1.1 19.55,1.85 v19.1,1.4
V_3.0  (via drill 0.38)
  Top 0.152: C2.1 29.77,6.95 U$11.3 31.55,6.95 31.7,7.1 31.7,8.8 v31.5,9 | R4.2 19.1,3.6 v19.1,4.6 | C5.1 20.52,5.3 19.7,5.3 19.1,4.7 v19.1,4.6 | v16,9.1 16,9.08 C29.1 | C10.1 v3,7.5 1.5,6 | 10.7,9.8 10.7,12.5 10.6,12.6 8.8,12.6 8.7,12.7 8.7,13.7 7.92,14.48 R35.2 3.38,14.48 0.4,11.5 0.4,7.1 1.5,6 | 10.1,8.5 10.5,8.9 U$27.5 10.7,9.75 10.7,9.8 | R34.2 R27.2 7.48,0.5 6,0.5 | 19,4.7 v19.1,4.6 | v18.6,8.1 18.6,5.1 v19.1,4.6 | 1.5,6 U$27.1 1,4.75 R39.2 R38.2 R37.2 5.52,2.68 6,2.2 6,0.5 | 6,0.5 v5,0.5 | 10.7,9.8 v10.9,10
  Route15 0.152: v18.6,8.1 17.6,9.1 v16,9.1 11.8,9.1 v10.9,10 | v18.6,8.1 18.9,8.1 | v31.5,9 30.5,10 28.4,10 27.3,11.1 v24.7,11.1 24.4,10.8 24.4,10.5 23.6,9.7 21.9,9.7 21.8,9.6 20.5,9.6 19,8.1 v18.6,8.1
  Bottom 0.152: U$1.3 19.55,4.15 v19.1,4.6 | IC6.4 15.95,9.05 v16,9.1 | U$20.3 3.25,7.25 v3,7.5 | R25.2 25,11.4 v24.7,11.1 24.7,13.9 25.1,14.3 R36.1
V_BATT  (via drill 0.38)
  Top 0.152: U$11.5 32.2,7.6 32.1,7.5 32.1,6.3 31.8,6 v30,6 28.9,6 28.4,6.5 C8.1 | C31.1 arc-90 15.92,0.5 v15.2,0.5
  Top 0.4: C30.1 15.65,1.35 15.2,0.9 v15.2,0.5
  Route2 0.5: v15.2,0.5 25.8,0.5 26.7,1.4 29.2,1.4 30,2.2 v30,6
  Route15 0.152: v11.4,0.5 v15.2,0.5
  Route15 0.5: v15.2,0.5 26,0.5 26.9,1.4 29.2,1.4 30,2.2 v30,6
  Bottom 0.152: IC7.15 12.07,4.33 10.9,3.15 10.9,1.1 11.4,0.6 v11.4,0.5
  Bottom 0.4: U$2.3 28.29,4.25 D1.A v30,6 R1.2 | IC7.10 15.22,0.53 v15.2,0.5
V_BUS  (via drill 0.38)
  Top 0.152: R6.1 R10.2 | R10.2 C7.1 | C1.1 23.1,2.7 v22.8,3 | R10.2 v28.7,2.6
  Top 0.4: v28.7,2.6 29.8,3.7 PWR_BUS.V+
  Route15 0.5: v22.8,3 24.1,1.7 25.5,1.7 26.4,2.6 v28.7,2.6
  Bottom 0.152: U$1.2 U$1.6 v22.8,3
  Bottom 0.4: U$2.4 29.69,1.39 D1.C 30,2.3 31.4,3.7 PWR_BUS.V+